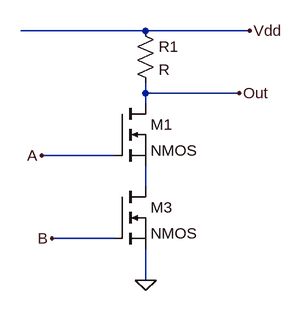
[diagram p0: schematic Nmos AND.asc]
Nmos AND.asc, the LTspice schematic file:
Version 4
SHEET 1 880 680
WIRE 208 -160 16 -160
WIRE 368 -160 208 -160
WIRE 208 -64 208 -80
WIRE 352 -64 208 -64
WIRE 208 -48 208 -64
WIRE 160 32 48 32
WIRE 208 80 208 48
WIRE 160 160 64 160
WIRE 208 224 208 176
FLAG 48 32 A
FLAG 368 -160 Vdd
FLAG 208 224 0
FLAG 64 160 B
FLAG 352 -64 Out
SYMBOL nmos 160 -48 R0
SYMATTR InstName M1
SYMBOL res 192 -176 R0
SYMATTR InstName R1
SYMBOL nmos 160 80 R0
SYMATTR InstName M3

The netlist it stands for:
* Nmos AND.asc
M1 Out A N001 N001 NMOS
R1 Vdd Out R
M3 N001 B 0 0 NMOS
.model NMOS NMOS
.model PMOS PMOS
.lib standard.mos
.backanno
.end